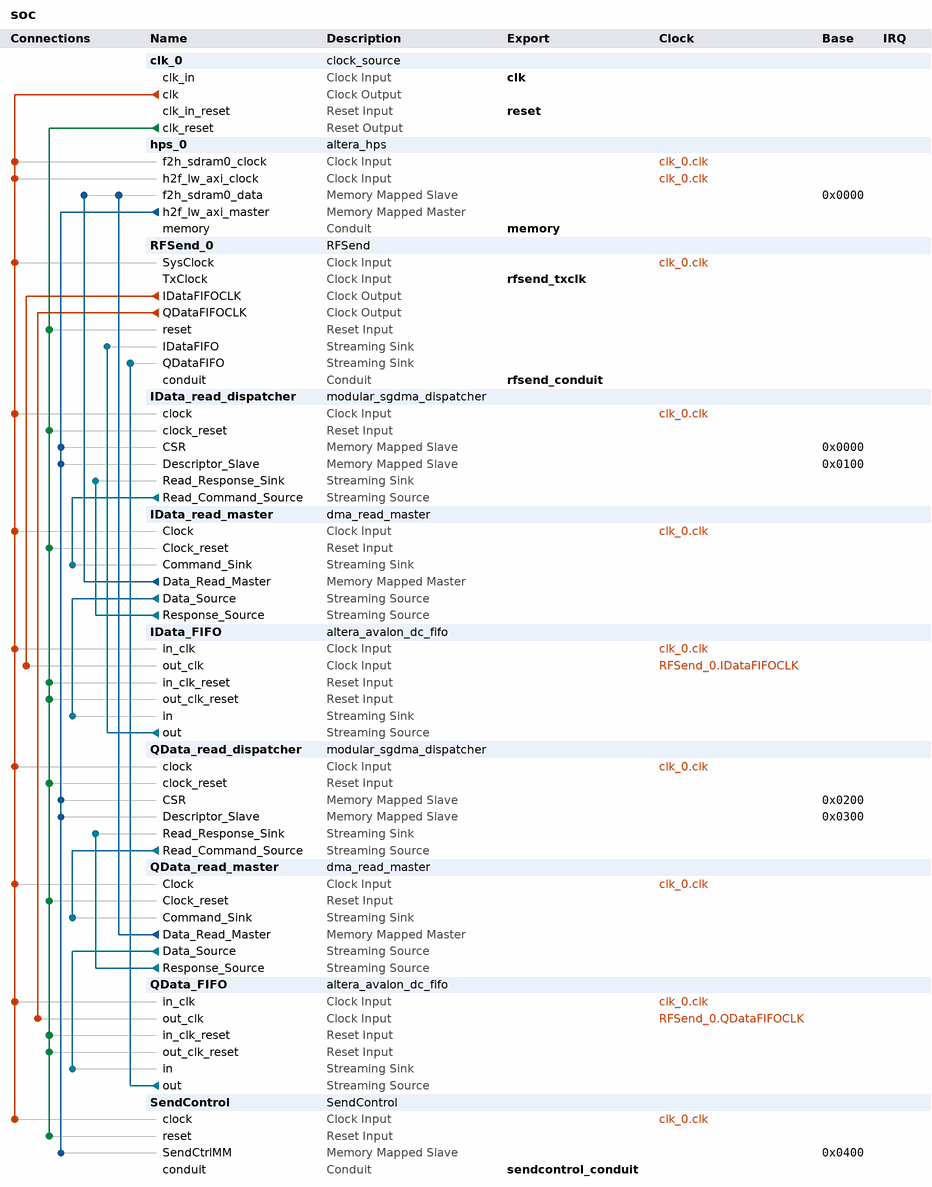
[diagram p0: system contents]
# Platform Designer (Qsys) system soc, Cyclone V 5CSXFC6D6F31C6
# Parameters at their usual value, and those the tool derives, are not listed.
package require -exact qsys 15.0
create_system soc
set_project_property DEVICE_FAMILY {Cyclone V}
set_project_property DEVICE 5CSXFC6D6F31C6

add_instance clk_0 clock_source 15.0
set_instance_parameter_value clk_0 clockFrequency 50000000

add_instance hps_0 altera_hps 15.0
set_instance_parameter_value hps_0 EMAC1_Mode N/A
set_instance_parameter_value hps_0 EMAC1_PinMuxing Unused
set_instance_parameter_value hps_0 F2SCLK_COLDRST_Enable false
set_instance_parameter_value hps_0 F2SCLK_DBGRST_Enable false
set_instance_parameter_value hps_0 F2SCLK_WARMRST_Enable false
set_instance_parameter_value hps_0 F2SDRAM_Type {Avalon-MM Read-Only}
set_instance_parameter_value hps_0 F2SDRAM_Width 64
set_instance_parameter_value hps_0 F2SINTERRUPT_Enable false
set_instance_parameter_value hps_0 F2S_Width 0
set_instance_parameter_value hps_0 FPGA_PERIPHERAL_OUTPUT_CLOCK_FREQ_EMAC0_GTX_CLK 100
set_instance_parameter_value hps_0 FPGA_PERIPHERAL_OUTPUT_CLOCK_FREQ_EMAC0_MD_CLK 2.5
set_instance_parameter_value hps_0 FPGA_PERIPHERAL_OUTPUT_CLOCK_FREQ_EMAC1_GTX_CLK 100
set_instance_parameter_value hps_0 FPGA_PERIPHERAL_OUTPUT_CLOCK_FREQ_EMAC1_MD_CLK 2.5
set_instance_parameter_value hps_0 HPS_PROTOCOL DDR3
set_instance_parameter_value hps_0 I2C0_Mode N/A
set_instance_parameter_value hps_0 I2C0_PinMuxing Unused
set_instance_parameter_value hps_0 I2C1_Mode N/A
set_instance_parameter_value hps_0 I2C1_PinMuxing Unused
set_instance_parameter_value hps_0 LWH2F_Enable true
set_instance_parameter_value hps_0 MEM_BANKADDR_WIDTH 3
set_instance_parameter_value hps_0 MEM_CLK_FREQ 400.0
set_instance_parameter_value hps_0 MEM_COL_ADDR_WIDTH 10
set_instance_parameter_value hps_0 MEM_DQ_WIDTH 32
set_instance_parameter_value hps_0 MEM_DRV_STR RZQ/6
set_instance_parameter_value hps_0 MEM_ROW_ADDR_WIDTH 15
set_instance_parameter_value hps_0 MEM_RTT_NOM RZQ/6
set_instance_parameter_value hps_0 MEM_RTT_WR {Dynamic ODT off}
set_instance_parameter_value hps_0 MEM_TCL 7
set_instance_parameter_value hps_0 MEM_TFAW_NS 30.0
set_instance_parameter_value hps_0 MEM_TRAS_NS 35.0
set_instance_parameter_value hps_0 MEM_TRCD_NS 13.75
set_instance_parameter_value hps_0 MEM_TRFC_NS 260.0
set_instance_parameter_value hps_0 MEM_TRP_NS 13.75
set_instance_parameter_value hps_0 MEM_TRRD_NS 10.0
set_instance_parameter_value hps_0 MEM_TRTP_NS 10.0
set_instance_parameter_value hps_0 MEM_VENDOR JEDEC
set_instance_parameter_value hps_0 MEM_WTCL 6
set_instance_parameter_value hps_0 QSPI_Mode N/A
set_instance_parameter_value hps_0 QSPI_PinMuxing Unused
set_instance_parameter_value hps_0 REF_CLK_FREQ 25.0
set_instance_parameter_value hps_0 S2F_Width 0
set_instance_parameter_value hps_0 SDIO_Mode N/A
set_instance_parameter_value hps_0 SDIO_PinMuxing Unused
set_instance_parameter_value hps_0 SPIM1_Mode N/A
set_instance_parameter_value hps_0 SPIM1_PinMuxing Unused
set_instance_parameter_value hps_0 STM_Enable false
set_instance_parameter_value hps_0 TIMING_BOARD_AC_SKEW 0.03
set_instance_parameter_value hps_0 TIMING_BOARD_AC_TO_CK_SKEW 0.0
set_instance_parameter_value hps_0 TIMING_BOARD_DQ_TO_DQS_SKEW 0.0
set_instance_parameter_value hps_0 TIMING_BOARD_MAX_CK_DELAY 0.03
set_instance_parameter_value hps_0 TIMING_BOARD_MAX_DQS_DELAY 0.02
set_instance_parameter_value hps_0 TIMING_BOARD_SKEW_BETWEEN_DQS 0.08
set_instance_parameter_value hps_0 TIMING_BOARD_SKEW_CKDQS_DIMM_MAX 0.16
set_instance_parameter_value hps_0 TIMING_BOARD_SKEW_CKDQS_DIMM_MIN 0.09
set_instance_parameter_value hps_0 TIMING_BOARD_SKEW_WITHIN_DQS 0.01
set_instance_parameter_value hps_0 TIMING_TDH 65
set_instance_parameter_value hps_0 TIMING_TDQSCK 255
set_instance_parameter_value hps_0 TIMING_TDQSQ 125
set_instance_parameter_value hps_0 TIMING_TDS 30
set_instance_parameter_value hps_0 TIMING_TIH 140
set_instance_parameter_value hps_0 TIMING_TIS 180
set_instance_parameter_value hps_0 TIMING_TQSH 0.4
set_instance_parameter_value hps_0 UART0_Mode N/A
set_instance_parameter_value hps_0 UART0_PinMuxing Unused
set_instance_parameter_value hps_0 USB1_Mode N/A
set_instance_parameter_value hps_0 USB1_PinMuxing Unused
set_instance_parameter_value hps_0 desired_cfg_clk_mhz 100.0
set_instance_parameter_value hps_0 desired_qspi_clk_mhz 400.0

add_instance RFSend_0 RFSend 1.0

add_instance IData_read_dispatcher modular_sgdma_dispatcher 15.0
set_instance_parameter_value IData_read_dispatcher BURST_ENABLE 0
set_instance_parameter_value IData_read_dispatcher BURST_WRAPPING_SUPPORT 0
set_instance_parameter_value IData_read_dispatcher CSR_ADDRESS_WIDTH 3
set_instance_parameter_value IData_read_dispatcher DATA_FIFO_DEPTH 32
set_instance_parameter_value IData_read_dispatcher DATA_WIDTH 32
set_instance_parameter_value IData_read_dispatcher DESCRIPTOR_FIFO_DEPTH 8
set_instance_parameter_value IData_read_dispatcher ENHANCED_FEATURES 0
set_instance_parameter_value IData_read_dispatcher GUI_RESPONSE_PORT 0
set_instance_parameter_value IData_read_dispatcher MAX_BURST_COUNT 2
set_instance_parameter_value IData_read_dispatcher MAX_BYTE 1024
set_instance_parameter_value IData_read_dispatcher MAX_STRIDE 1
set_instance_parameter_value IData_read_dispatcher MODE 1
set_instance_parameter_value IData_read_dispatcher PROGRAMMABLE_BURST_ENABLE 0
set_instance_parameter_value IData_read_dispatcher STRIDE_ENABLE 0
set_instance_parameter_value IData_read_dispatcher TRANSFER_TYPE {Aligned Accesses}

add_instance IData_read_master dma_read_master 15.0
set_instance_parameter_value IData_read_master BURST_ENABLE 0
set_instance_parameter_value IData_read_master CHANNEL_ENABLE 0
set_instance_parameter_value IData_read_master CHANNEL_WIDTH 8
set_instance_parameter_value IData_read_master DATA_WIDTH 16
set_instance_parameter_value IData_read_master ERROR_ENABLE 0
set_instance_parameter_value IData_read_master ERROR_WIDTH 8
set_instance_parameter_value IData_read_master FIFO_DEPTH 128
set_instance_parameter_value IData_read_master FIFO_SPEED_OPTIMIZATION 1
set_instance_parameter_value IData_read_master GUI_BURST_WRAPPING_SUPPORT 0
set_instance_parameter_value IData_read_master GUI_MAX_BURST_COUNT 2
set_instance_parameter_value IData_read_master GUI_PROGRAMMABLE_BURST_ENABLE 0
set_instance_parameter_value IData_read_master GUI_STRIDE_WIDTH 1
set_instance_parameter_value IData_read_master LENGTH_WIDTH 32
set_instance_parameter_value IData_read_master PACKET_ENABLE 0
set_instance_parameter_value IData_read_master STRIDE_ENABLE 0
set_instance_parameter_value IData_read_master TRANSFER_TYPE {Aligned Accesses}

add_instance IData_FIFO altera_avalon_dc_fifo 15.0
set_instance_parameter_value IData_FIFO BITS_PER_SYMBOL 8
set_instance_parameter_value IData_FIFO FIFO_DEPTH 2048
set_instance_parameter_value IData_FIFO RD_SYNC_DEPTH 16
set_instance_parameter_value IData_FIFO SYMBOLS_PER_BEAT 2
set_instance_parameter_value IData_FIFO USE_PACKETS 0
set_instance_parameter_value IData_FIFO WR_SYNC_DEPTH 16

add_instance QData_read_dispatcher modular_sgdma_dispatcher 15.0
set_instance_parameter_value QData_read_dispatcher BURST_ENABLE 0
set_instance_parameter_value QData_read_dispatcher BURST_WRAPPING_SUPPORT 0
set_instance_parameter_value QData_read_dispatcher CSR_ADDRESS_WIDTH 3
set_instance_parameter_value QData_read_dispatcher DATA_FIFO_DEPTH 32
set_instance_parameter_value QData_read_dispatcher DATA_WIDTH 32
set_instance_parameter_value QData_read_dispatcher DESCRIPTOR_FIFO_DEPTH 8
set_instance_parameter_value QData_read_dispatcher ENHANCED_FEATURES 0
set_instance_parameter_value QData_read_dispatcher GUI_RESPONSE_PORT 0
set_instance_parameter_value QData_read_dispatcher MAX_BURST_COUNT 2
set_instance_parameter_value QData_read_dispatcher MAX_BYTE 1024
set_instance_parameter_value QData_read_dispatcher MAX_STRIDE 1
set_instance_parameter_value QData_read_dispatcher MODE 1
set_instance_parameter_value QData_read_dispatcher PROGRAMMABLE_BURST_ENABLE 0
set_instance_parameter_value QData_read_dispatcher STRIDE_ENABLE 0
set_instance_parameter_value QData_read_dispatcher TRANSFER_TYPE {Aligned Accesses}

add_instance QData_read_master dma_read_master 15.0
set_instance_parameter_value QData_read_master BURST_ENABLE 0
set_instance_parameter_value QData_read_master CHANNEL_ENABLE 0
set_instance_parameter_value QData_read_master CHANNEL_WIDTH 8
set_instance_parameter_value QData_read_master DATA_WIDTH 16
set_instance_parameter_value QData_read_master ERROR_ENABLE 0
set_instance_parameter_value QData_read_master ERROR_WIDTH 8
set_instance_parameter_value QData_read_master FIFO_DEPTH 128
set_instance_parameter_value QData_read_master FIFO_SPEED_OPTIMIZATION 1
set_instance_parameter_value QData_read_master GUI_BURST_WRAPPING_SUPPORT 0
set_instance_parameter_value QData_read_master GUI_MAX_BURST_COUNT 2
set_instance_parameter_value QData_read_master GUI_PROGRAMMABLE_BURST_ENABLE 0
set_instance_parameter_value QData_read_master GUI_STRIDE_WIDTH 1
set_instance_parameter_value QData_read_master LENGTH_WIDTH 32
set_instance_parameter_value QData_read_master PACKET_ENABLE 0
set_instance_parameter_value QData_read_master STRIDE_ENABLE 0
set_instance_parameter_value QData_read_master TRANSFER_TYPE {Aligned Accesses}

add_instance QData_FIFO altera_avalon_dc_fifo 15.0
set_instance_parameter_value QData_FIFO BITS_PER_SYMBOL 8
set_instance_parameter_value QData_FIFO FIFO_DEPTH 2048
set_instance_parameter_value QData_FIFO RD_SYNC_DEPTH 16
set_instance_parameter_value QData_FIFO SYMBOLS_PER_BEAT 2
set_instance_parameter_value QData_FIFO USE_PACKETS 0
set_instance_parameter_value QData_FIFO WR_SYNC_DEPTH 16

add_instance SendControl SendControl 1.0

# connections
add_connection clk_0.clk hps_0.f2h_sdram0_clock clock
add_connection clk_0.clk hps_0.h2f_lw_axi_clock clock
add_connection clk_0.clk IData_FIFO.in_clk clock
add_connection clk_0.clk IData_read_dispatcher.clock clock
add_connection clk_0.clk IData_read_master.Clock clock
add_connection clk_0.clk QData_FIFO.in_clk clock
add_connection clk_0.clk QData_read_dispatcher.clock clock
add_connection clk_0.clk QData_read_master.Clock clock
add_connection clk_0.clk RFSend_0.SysClock clock
add_connection clk_0.clk SendControl.clock clock
add_connection RFSend_0.IDataFIFOCLK IData_FIFO.out_clk clock
add_connection RFSend_0.QDataFIFOCLK QData_FIFO.out_clk clock
add_connection clk_0.clk_reset IData_FIFO.in_clk_reset reset
add_connection clk_0.clk_reset IData_FIFO.out_clk_reset reset
add_connection clk_0.clk_reset IData_read_dispatcher.clock_reset reset
add_connection clk_0.clk_reset IData_read_master.Clock_reset reset
add_connection clk_0.clk_reset QData_FIFO.in_clk_reset reset
add_connection clk_0.clk_reset QData_FIFO.out_clk_reset reset
add_connection clk_0.clk_reset QData_read_dispatcher.clock_reset reset
add_connection clk_0.clk_reset QData_read_master.Clock_reset reset
add_connection clk_0.clk_reset RFSend_0.reset reset
add_connection clk_0.clk_reset SendControl.reset reset
add_connection hps_0.h2f_lw_axi_master IData_read_dispatcher.CSR avalon
set_connection_parameter_value hps_0.h2f_lw_axi_master/IData_read_dispatcher.CSR baseAddress 0x0000
add_connection hps_0.h2f_lw_axi_master IData_read_dispatcher.Descriptor_Slave avalon
set_connection_parameter_value hps_0.h2f_lw_axi_master/IData_read_dispatcher.Descriptor_Slave baseAddress 0x0100
add_connection hps_0.h2f_lw_axi_master QData_read_dispatcher.CSR avalon
set_connection_parameter_value hps_0.h2f_lw_axi_master/QData_read_dispatcher.CSR baseAddress 0x0200
add_connection hps_0.h2f_lw_axi_master QData_read_dispatcher.Descriptor_Slave avalon
set_connection_parameter_value hps_0.h2f_lw_axi_master/QData_read_dispatcher.Descriptor_Slave baseAddress 0x0300
add_connection hps_0.h2f_lw_axi_master SendControl.SendCtrlMM avalon
set_connection_parameter_value hps_0.h2f_lw_axi_master/SendControl.SendCtrlMM baseAddress 0x0400
add_connection IData_read_master.Data_Read_Master hps_0.f2h_sdram0_data avalon
set_connection_parameter_value IData_read_master.Data_Read_Master/hps_0.f2h_sdram0_data baseAddress 0x0000
add_connection QData_read_master.Data_Read_Master hps_0.f2h_sdram0_data avalon
set_connection_parameter_value QData_read_master.Data_Read_Master/hps_0.f2h_sdram0_data baseAddress 0x0000
add_connection IData_FIFO.out RFSend_0.IDataFIFO avalon_streaming
add_connection IData_read_dispatcher.Read_Command_Source IData_read_master.Command_Sink avalon_streaming
add_connection IData_read_master.Data_Source IData_FIFO.in avalon_streaming
add_connection IData_read_master.Response_Source IData_read_dispatcher.Read_Response_Sink avalon_streaming
add_connection QData_FIFO.out RFSend_0.QDataFIFO avalon_streaming
add_connection QData_read_dispatcher.Read_Command_Source QData_read_master.Command_Sink avalon_streaming
add_connection QData_read_master.Data_Source QData_FIFO.in avalon_streaming
add_connection QData_read_master.Response_Source QData_read_dispatcher.Read_Response_Sink avalon_streaming

# exported interfaces
add_interface clk clock sink
set_interface_property clk EXPORT_OF clk_0.clk_in
add_interface memory conduit end
set_interface_property memory EXPORT_OF hps_0.memory
add_interface reset reset sink
set_interface_property reset EXPORT_OF clk_0.clk_in_reset
add_interface rfsend_conduit conduit end
set_interface_property rfsend_conduit EXPORT_OF RFSend_0.conduit
add_interface rfsend_txclk clock sink
set_interface_property rfsend_txclk EXPORT_OF RFSend_0.TxClock
add_interface sendcontrol_conduit conduit end
set_interface_property sendcontrol_conduit EXPORT_OF SendControl.conduit

set_interconnect_requirement {$system} qsys_mm.clockCrossingAdapter HANDSHAKE
set_interconnect_requirement {$system} qsys_mm.enableEccProtection FALSE
set_interconnect_requirement {$system} qsys_mm.insertDefaultSlave FALSE
set_interconnect_requirement {$system} qsys_mm.maxAdditionalLatency 1
set_interconnect_requirement IData_read_master.Data_Read_Master qsys_mm.security SECURE
set_interconnect_requirement QData_read_master.Data_Read_Master qsys_mm.security SECURE
set_interconnect_requirement hps_0.f2h_sdram0_data qsys_mm.security SECURE

save_system soc.qsys
